# Altium schematic sheet ETH_Wifi.SCHDOC
size A3; SheetNumber: 0; SheetTotal: 0
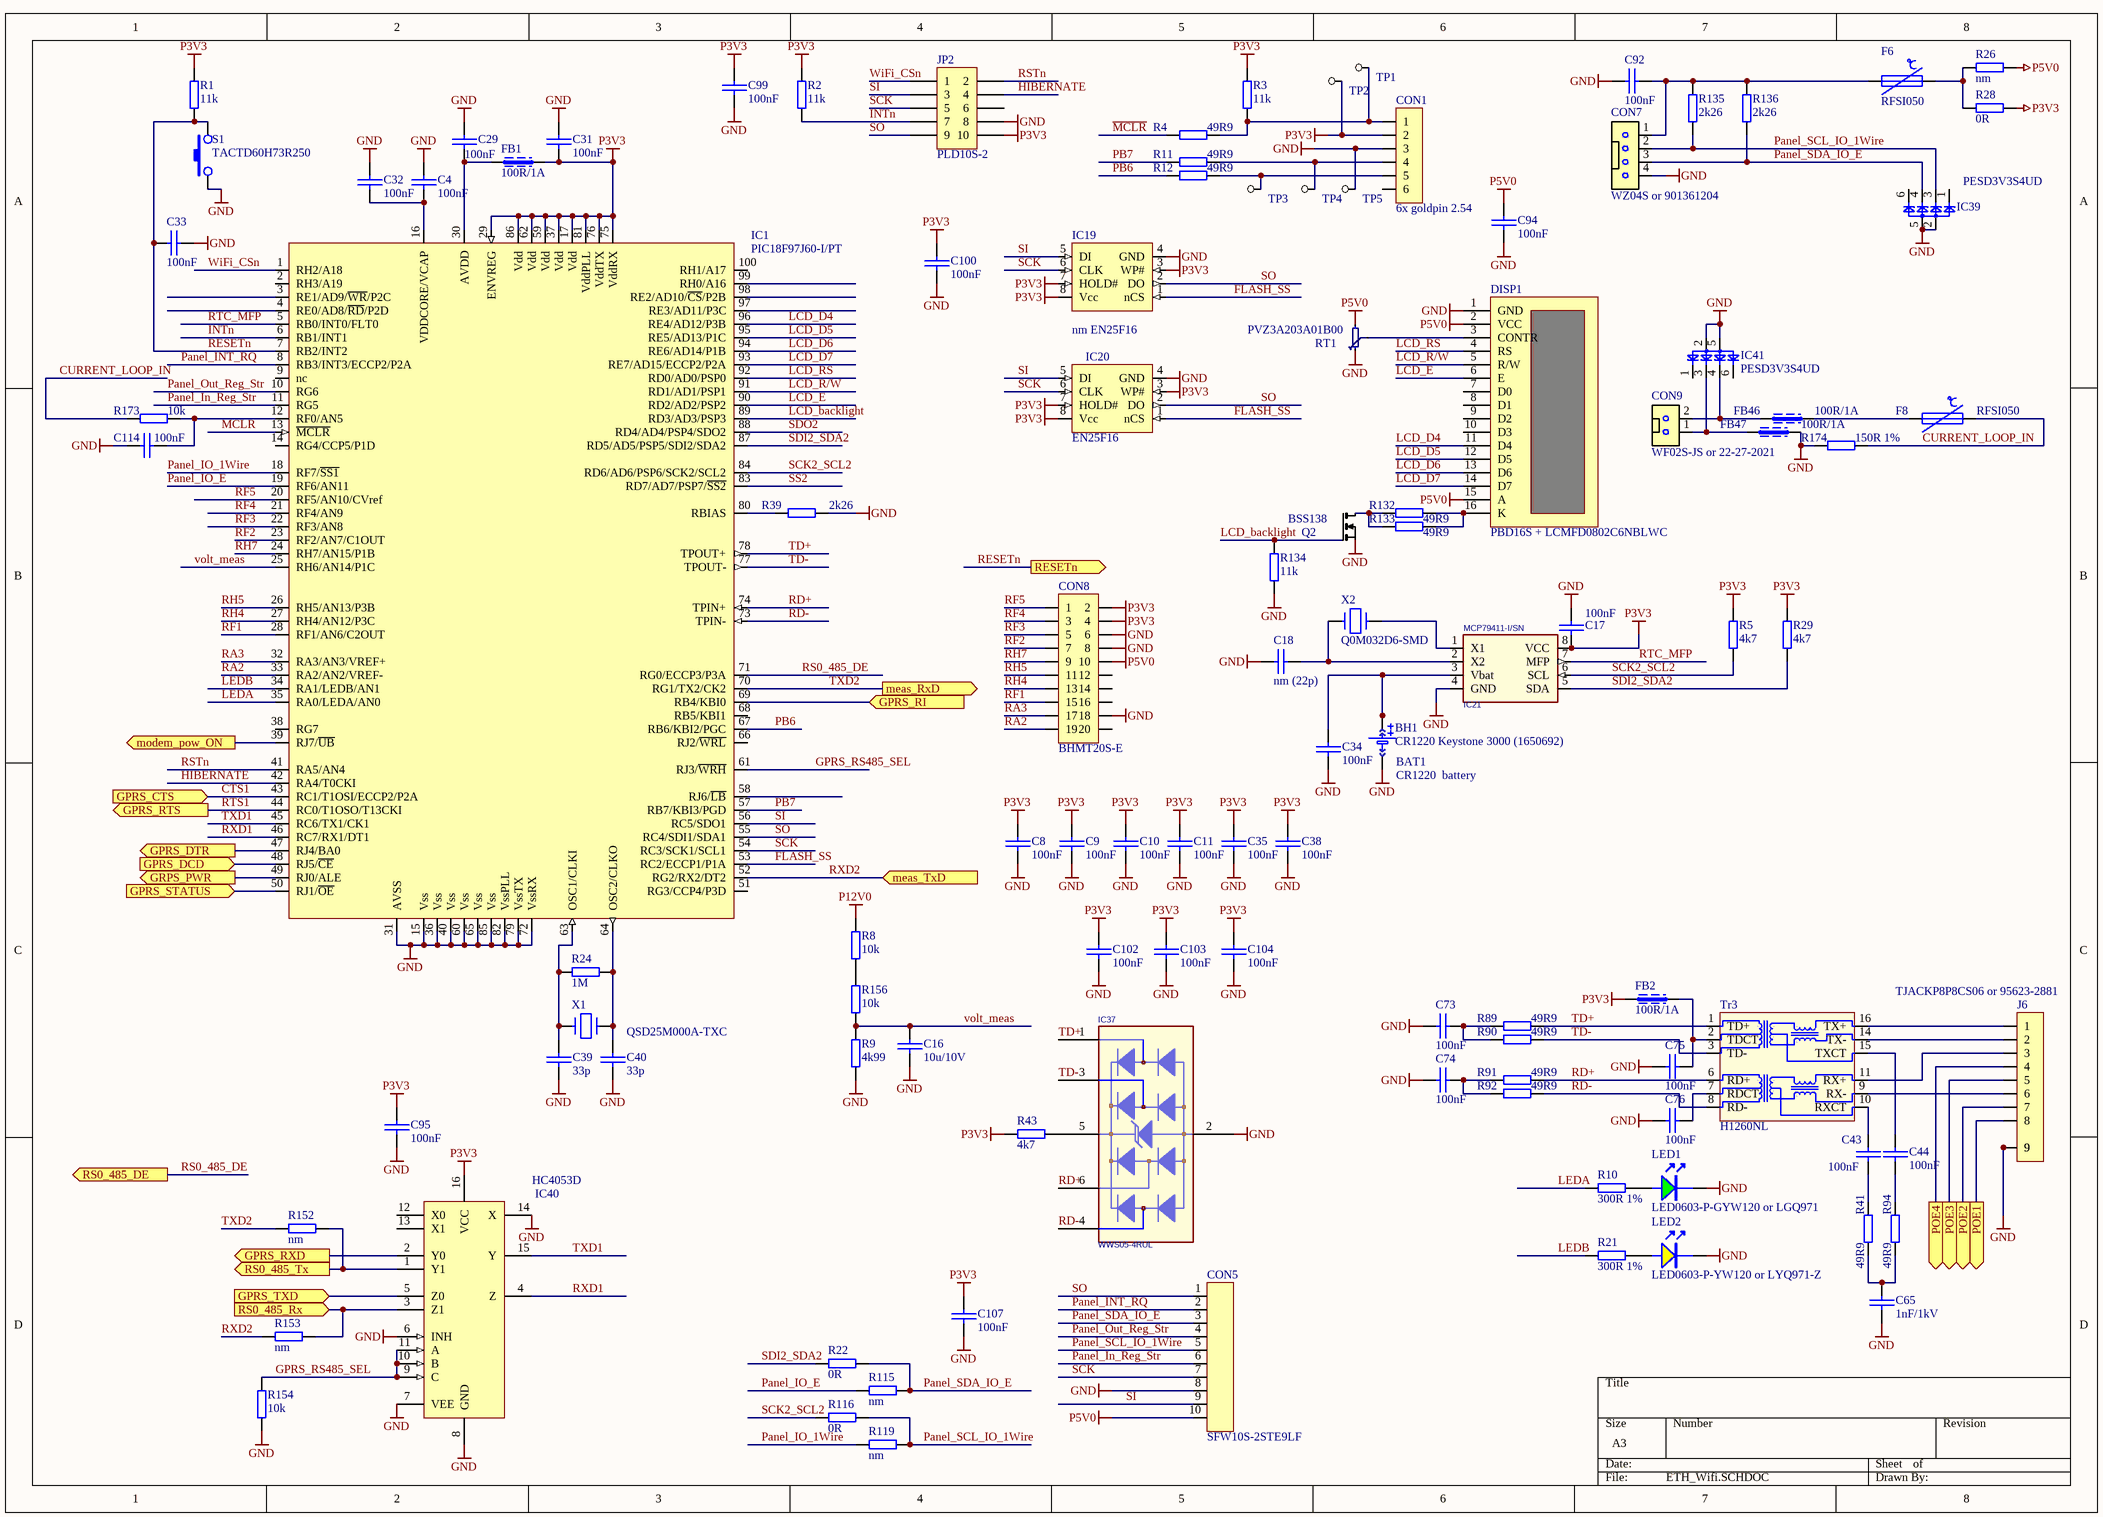
[diagram p0: ETH_Wifi.SCHDOC]

## Parts
BAT1  CR1220  battery  [cr1220]
BH1  CR1220 Keystone 3000 (1650692)  [CR1220_Keystone_3000]
C4  100nF  [0402C]
C8  100nF  [0402C]
C9  100nF  [0402C]
C10  100nF  [0402C]
C11  100nF  [0402C]
C16  10u/10V  [0805C]
C17  100nF  [0402C]
C18  nm (22p)  [0603C]
C29  100nF  [0402C]
C31  100nF  [0402C]
C32  100nF  [0402C]
C33  100nF  [0402C]
C34  100nF  [0402C]
C35  100nF  [0402C]
C38  100nF  [0402C]
C39  33p  [0603C]
C40  33p  [0603C]
C43  100nF  [0402C]
C44  100nF  [0402C]
C65  1nF/1kV  [1206C]
C73  100nF  [0402C]
C74  100nF  [0402C]
C75  100nF  [0402C]
C76  100nF  [0402C]
C92  100nF  [0402C]
C94  100nF  [0402C]
C95  100nF  [0402C]
C99  100nF  [0402C]
C100  100nF  [0402C]
C102  100nF  [0402C]
C103  100nF  [0402C]
C104  100nF  [0402C]
C107  100nF  [0402C]
C114  100nF  [0402C]
CON1  6x goldpin 2.54  [SIP6]
CON5  SFW10S-2STE9LF  [SFW10S-2STE9LF]
CON7  WZ04S or 901361204  [WZ04S]
CON8  BHMT20S-E  [BHMT20S]
CON9  WF02S-JS or 22-27-2021  [CON_WF02S-LF]
DISP1  PBD16S + LCMFD0802C6NBLWC  [LCMFD0802C6NBLWC]
F6  RFSI050  [0805R]
F8  RFSI050  [0805R]
FB1  100R/1A  [0603L]
FB2  100R/1A  [0603L]
FB46  100R/1A  [0603L]
FB47  100R/1A  [0603L]
IC1  PIC18F97J60-I/PT  [lqfp100_12x12mm]
IC19  nm EN25F16  [SO-8L]
IC20  EN25F16  [SO-8]
IC21  MCP79411-I/SN  [SO-8]
IC37  WWS05-4RUL  [SOT23-6]
IC39  PESD3V3S4UD  [SOT457]
IC40  HC4053D  [SO-16]
IC41  PESD3V3S4UD  [SOT457]
J6  TJACKP8P8CS06 or 95623-2881  [ETH_VERT_95623-2881]
JP2  PLD10S-2  [HEADER5X2]
LED1  LED0603-P-GYW120 or LGQ971  [led_0603G]
LED2  LED0603-P-YW120 or LYQ971-Z  [led_0603B]
Q2  BSS138  [SOT-23]
R1  11k  [0603R]
R2  11k  [0603R]
R3  11k  [0603R]
R4  49R9  [0603R]
R5  4k7  [0402R]
R8  10k  [0402R]
R9  4k99  [0603R]
R10  300R 1%  [0603R]
R11  49R9  [0603R]
R12  49R9  [0603R]
R21  300R 1%  [0603R]
R22  0R  [0603R]
R24  1M  [0603R]
R26  nm  [0603R]
R28  0R  [0603R]
R29  4k7  [0402R]
R39  2k26  [0603R]
R41  49R9  [0603]
R43  4k7  [0402R]
R89  49R9  [0603R]
R90  49R9  [0603R]
R91  49R9  [0603R]
R92  49R9  [0603R]
R94  49R9  [0603]
R115  nm  [0603R]
R116  0R  [0603R]
R119  nm  [0603R]
R132  49R9  [0603R]
R133  49R9  [0603R]
R134  11k  [0603R]
R135  2k26  [0603R]
R136  2k26  [0603R]
R152  nm  [0603R]
R153  nm  [0603R]
R154  10k  [0402R]
R156  10k  [0402R]
R173  10k  [0402R]
R174  150R 1%  [0805R]
RT1  PVZ3A203A01B00  [TRIMPOT_PVZ3A]
S1  TACTD60H73R250  [TACT-DQ62H73G160]
TP1  TP_nMCLR  [TP_large]  (value not drawn)
TP2  TP_3V3_ctrl  [TP_large]  (value not drawn)
TP3  TP_PB6  [TP_large]  (value not drawn)
TP4  TP_PB7  [TP_large]  (value not drawn)
TP5  TP_GND_ctrl  [TP_large]  (value not drawn)
Tr3  H1260NL  [H1260NL]
X1  QSD25M000A-TXC  [HC-49SM]
X2  Q0M032D6-SMD  [crystal_85SMX]

## Ports
GPRS_CTS (in), GPRS_DCD (in), GPRS_DTR (out), GPRS_RI (in), GPRS_RTS (out), GPRS_RXD (out), GPRS_STATUS (in), GPRS_TXD (in), GRPS_PWR (out), meas_RxD (out), meas_TxD (in), modem_pow_ON (out), POE1 (out), POE2 (out), POE3 (out), POE4 (out), RESETn (out), RS0_485_DE (out), RS0_485_Rx (in), RS0_485_Tx (out)

## Nets
GND: BH1.neg(+) C4.1 C8.1 C9.2 C10.2 C11.2 C16.2 C17.2 C18.2 C29.1 C31.1 C32.1 C33.2 C34.2 C35.2 C38.2 C39.1 C40.1 C65.2 C73.1 C74.1 C75.1 C76.1 C92.1 C94.1 C95.2 C99.2 C100.2 C102.2 C103.2 C104.2 C107.2 C114.1 CON1.3 CON5.8 CON7.4 CON8.6 CON8.8 CON8.18 DISP1.1(GND) FB47.2 IC1.15(Vss) IC1.31(AVSS) IC1.36(Vss) IC1.40(Vss) IC1.60(Vss) IC1.65(Vss) IC1.72(VssRX) IC1.79(VssTX) IC1.82(VssPLL) IC1.85(Vss) IC19.4(GND) IC20.4(GND) IC21.4(GND) IC37.2 IC39.2 IC39.5 IC40.6(INH) IC40.7(VEE) IC40.8(GND) IC40.14(X) IC41.2 IC41.5 J6.9a(9) J6.9b(9) JP2.8 LED1.K LED2.K Q2.2(S) R9.1 R39.2 R134.1 R154.1 R174.1 RT1.3 S1.1 TP5.1
P3V3: C8.2 C9.1 C10.1 C11.1 C17.1 C31.2 C35.1 C38.1 C95.1 C99.1 C100.1 C102.1 C103.1 C104.1 C107.1 CON1.2 CON8.2 CON8.4 FB1.2 FB2.1 IC1.17(Vdd) IC1.29(ENVREG) IC1.37(Vdd) IC1.59(Vdd) IC1.62(Vdd) IC1.75(VddRX) IC1.76(VddTX) IC1.81(VddPLL) IC1.86(Vdd) IC19.3(WP#) IC19.7(HOLD#) IC19.8(Vcc) IC20.3(WP#) IC20.7(HOLD#) IC20.8(Vcc) IC21.8(VCC) IC40.16(VCC) JP2.10 R1.2 R2.2 R3.2 R5.1 R28.2 R29.1 R43.1 TP2.1
P5V0: C94.2 CON5.10 CON8.10 DISP1.2(VCC) DISP1.15(A) R26.2 RT1.1
P12V0: R8.2
CTS1: IC1.43(RC1/T1OSI/ECCP2/P2A) ; port GPRS_CTS
CURRENT_LOOP_IN: F8.2 R173.1 R174.2
FLASH_SS: IC1.53(RC2/ECCP1/P1A) IC19.1(nCS) IC20.1(nCS)
GPRS_DCD: IC1.48(RJ5/~{CE}) ; port GPRS_DCD
GPRS_DTR: IC1.47(RJ4/BA0) ; port GPRS_DTR
GPRS_RI: IC1.69(RB4/KBI0) ; port GPRS_RI
GPRS_RS485_SEL: IC1.61(RJ3/~{WRH}) IC40.9(C) IC40.10(B) IC40.11(A) R154.2
GPRS_RXD: IC40.2(Y0) ; port GPRS_RXD
GPRS_STATUS: IC1.50(RJ1/~{OE}) ; port GPRS_STATUS
GPRS_TXD: IC40.5(Z0) ; port GPRS_TXD
GRPS_PWR: IC1.49(RJ0/ALE) ; port GRPS_PWR
HIBERNATE: IC1.42(RA4/T0CKI) JP2.4
INTn: IC1.6(RB1/INT1) JP2.7 R2.1
LCD_backlight: IC1.89(RD3/AD3/PSP3) Q2.1(G) R134.2
LCD_D4: DISP1.11(D4) IC1.96(RE4/AD12/P3B)
LCD_D5: DISP1.12(D5) IC1.95(RE5/AD13/P1C)
LCD_D6: DISP1.13(D6) IC1.94(RE6/AD14/P1B)
LCD_D7: DISP1.14(D7) IC1.93(RE7/AD15/ECCP2/P2A)
LCD_E: DISP1.6(E) IC1.90(RD2/AD2/PSP2)
LCD_R/W: DISP1.5(R/W) IC1.91(RD1/AD1/PSP1)
LCD_RS: DISP1.4(RS) IC1.92(RD0/AD0/PSP0)
LEDA: IC1.35(RA0/LEDA/AN0) R10.2
LEDB: IC1.34(RA1/LEDB/AN1) R21.2
~{MCLR}: IC1.13(~{MCLR}) R4.1
modem_pow_ON: IC1.39(RJ7/~{UB}) ; port modem_pow_ON
Panel_In_Reg_Str: CON5.6 IC1.11(RG5)
Panel_INT_RQ: CON5.2 IC1.8(RB3/INT3/ECCP2/P2A)
Panel_IO_1Wire: IC1.18(RF7/~{SS1}) R119.2
Panel_IO_E: IC1.19(RF6/AN11) R115.2
Panel_Out_Reg_Str: CON5.4 IC1.10(RG6)
Panel_SCL_IO_1Wire: CON5.5 CON7.2 IC39.3 R116.1 R119.1 R135.2
Panel_SDA_IO_E: CON5.3 CON7.3 IC39.4 R22.1 R115.1 R136.2
PB6: IC1.67(RB6/KBI2/PGC) R12.1
PB7: IC1.57(RB7/KBI3/PGD) R11.1
POE1: J6.8 ; port POE1
POE2: J6.7 ; port POE2
POE3: J6.5 ; port POE3
POE4: J6.4 ; port POE4
RA2: CON8.19 IC1.33(RA2/AN2/VREF-)
RA3: CON8.17 IC1.32(RA3/AN3/VREF+)
RD+: IC1.74(TPIN+) IC37.6 R91.2 Tr3.6(RD+)
RD-: IC1.73(TPIN-) IC37.4 R92.2 Tr3.8(RD-)
RESETn: C33.1 IC1.7(RB2/INT2) R1.1 S1.2 ; port RESETn
RF1: CON8.15 IC1.28(RF1/AN6/C2OUT)
RF2: CON8.7 IC1.23(RF2/AN7/C1OUT)
RF3: CON8.5 IC1.22(RF3/AN8)
RF4: CON8.3 IC1.21(RF4/AN9)
RF5: CON8.1 IC1.20(RF5/AN10/CVref)
RH4: CON8.13 IC1.27(RH4/AN12/P3C)
RH5: CON8.11 IC1.26(RH5/AN13/P3B)
RH7: CON8.9 IC1.24(RH7/AN15/P1B)
RS0_485_DE: IC1.71(RG0/ECCP3/P3A) ; port RS0_485_DE
RS0_485_Rx: IC40.3(Z1) R153.1 ; port RS0_485_Rx
RS0_485_Tx: IC40.1(Y1) R152.1 ; port RS0_485_Tx
RSTn: IC1.41(RA5/AN4) JP2.2
RTC_MFP: IC1.5(RB0/INT0/FLT0) IC21.7(MFP)
RTS1: IC1.44(RC0/T1OSO/T13CKI) ; port GPRS_RTS
RXD1: IC1.46(RC7/RX1/DT1) IC40.4(Z)
RXD2: IC1.52(RG2/RX2/DT2) R153.2 ; port meas_TxD
SCK: CON5.7 IC1.54(RC3/SCK1/SCL1) IC19.6(CLK) IC20.6(CLK) JP2.5
SCK2_SCL2: IC1.84(RD6/AD6/PSP6/SCK2/SCL2) IC21.6(SCL) R5.2 R116.2
SDI2_SDA2: IC1.87(RD5/AD5/PSP5/SDI2/SDA2) IC21.5(SDA) R22.2 R29.2
SDO2: IC1.88(RD4/AD4/PSP4/SDO2)
SI: CON5.9 IC1.56(RC5/SDO1) IC19.5(DI) IC20.5(DI) JP2.3
SO: CON5.1 IC1.55(RC4/SDI1/SDA1) IC19.2(DO) IC20.2(DO) JP2.9
SS2: IC1.83(RD7/AD7/PSP7/~{SS2})
TD+: IC1.78(TPOUT+) IC37.1 R89.2 Tr3.1(TD+)
TD-: IC1.77(TPOUT-) IC37.3 R90.2 Tr3.3(TD-)
TXD1: IC1.45(RC6/TX1/CK1) IC40.15(Y)
TXD2: IC1.70(RG1/TX2/CK2) R152.2 ; port meas_RxD
volt_meas: C16.1 IC1.25(RH6/AN14/P1C) R9.2 R156.1
WiFi_CSn: IC1.1(RH2/A18) JP2.1
NetBH1_pos1: BH1.pos1(+) BH1.pos2(+) C34.1 IC21.3(Vbat)
NetC4_2: C4.2 C32.2 IC1.16(VDDCORE/VCAP)
NetC18_1: C18.1 IC21.2(X2) X2.4
NetC29_2: C29.2 FB1.1 IC1.30(AVDD)
NetC39_2: C39.2 IC1.63(OSC1/CLKI) R24.1 X1.1
NetC40_2: C40.2 IC1.64(OSC2/CLKO) R24.2 X1.2
NetC43_1: C43.1 R41.2
NetC43_2: C43.2 Tr3.10(RXCT)
NetC44_1: C44.1 R94.2
NetC44_2: C44.2 Tr3.15(TXCT)
NetC65_1: C65.1 R41.1 R94.1
NetC73_2: C73.2 R89.1 R90.1
NetC74_2: C74.2 R91.1 R92.1
NetC75_2: C75.2 FB2.2 Tr3.2(TDCT)
NetC76_2: C76.2 Tr3.7(RDCT)
NetC92_2: C92.2 CON7.1 F6.1 R135.1 R136.1
NetC114_2: C114.2 IC1.12(RF0/AN5) R173.2
NetCON1_1: CON1.1 R3.1 R4.2 TP1.1
NetCON1_4: CON1.4 R11.2 TP4.1
NetCON1_5: CON1.5 R12.2 TP3.1
NetCON9_1: CON9.1 FB47.1 IC41.3
NetCON9_2: CON9.2 FB46.1 IC41.4
NetDISP1_3: DISP1.3(CONTR) RT1.2
NetDISP1_16: DISP1.16(K) R132.2 R133.2
NetF6_2: F6.2 R26.1 R28.1
NetF8_1: F8.1 FB46.2
NetIC1_80: IC1.80(RBIAS) R39.1
NetIC21_1: IC21.1(X1) X2.1
NetIC37_5: IC37.5 R43.2
NetJ6_1: J6.1 Tr3.16(TX+)
NetJ6_2: J6.2 Tr3.14(TX-)
NetJ6_3: J6.3 Tr3.11(RX+)
NetJ6_6: J6.6 Tr3.9(RX-)
NetLED1_A: LED1.A R10.1
NetLED2_A: LED2.A R21.1
NetQ2_3: Q2.3(D) R132.1 R133.1
NetR8_1: R8.1 R156.2

Not connected (* = marked no-connect by the designer): CON1 6; CON8 12 14 16 20; DISP1 7(D0) 8(D1) 9(D2) 10(D3); IC1 2(RH3/A19) 3(RE1/AD9/~{WR}/P2C) 4(RE0/AD8/~{RD}/P2D) 9(nc) 14(RG4/CCP5/P1D) 38(RG7) 51(RG3/CCP4/P3D) 58(RJ6/~{LB}) 66(RJ2/~{WRL}) 68(RB5/KBI1) 97(RE3/AD11/P3C) 98(RE2/AD10/~{CS}/P2B) 99(RH0/A16) 100(RH1/A17); IC39 1 6; IC40 12(X0) 13(X1); IC41 1 6; JP2 6

## Library data of the parts
BAT1 = BATTERY_CR1220: CR-21220 Battery 3V 35mAh; Supplier 1: Farnell; Supplier Part Number 1: 1892664
BH1 = BATTERY_HOLD_CR1220: CR-1220 Battery holder; Supplier 1: Newark; Supplier Part Number 1: 66F5622
C4 C8-C11 C17 C29 C31-C35 C38 C43 C44 C73-C76 C92 C94 C95 C99 C100 C102-C104 C107 C114 = CAP_SMD_0402: Capacitor SMD; Supplier 1: Newark; Supplier Part Number 1: 14T3275
C16 = CAP_SMD_0805: Capacitor SMD; Supplier 1: Farnell; Supplier Part Number 1: 1833812
C18 = CAP_SMD_0603: Capacitor SMD
C39 C40 = CAP_SMD: Capacitor SMD
C65 = CAP_SMD_1206: Capacitor SMD; Supplier 1: Newark; Supplier Part Number 1: 90R7810
CON1 = CON6
CON5 = CON_ZIF_10_1mm_SMT_V: FCI ZIF 1mm connector (Farnell)
CON7 = CON_4_2.54_key: 2.54mm crimped terminal header
CON8 = CON_IDC20_SMT_2mm: 20 pin, IDC receptacle, 2mm
CON9 = CON_2_2.54_key: 2.54mm crimped terminal header
DISP1 = LCD_HD44780_LED_2x8: LCD character display socket with backlight
F6 F8 = F_PTC_0.05A: 50mA polymer FUSE
FB1 FB2 FB46 FB47 = L_FERRITE_BEAD: ferrite bead
IC1 = UPC_PIC18F96J65_PT
IC19 IC20 = MEM_EN25F16: FLASH (maritex)
IC21 = RTC_MCP79411: RTC with 1k EEPROM, RAM and 48bit unique ID; Supplier 1: Newark; Supplier Part Number 1: 76R6660
IC37 = D_TVS_WWS05-4RUL: TVS, 5V; Specification: SMD,ESD COMPONENT,ROHS
IC39 IC41 = D_TVS_PESD3V3S4UD: 3.3V TVS
IC40 = 4053
J6 = CON_MOD_8pin_V: Modular 8pin (Maritex or Molex)
JP2 = CON_HEADER 5X2: Goldpin 2.54mm
LED1 = LED_0603G: LED 0603 green; Supplier 1: Newark; Supplier Part Number 1: 05M0493
LED2 = LED_0603Y: LED 0603 yellow; Supplier 1: Newark; Supplier Part Number 1: 56P5112
Q2 = Q_BSS138
R1-R4 R10-R12 R21 R24 R39 R41 R89-R92 R94 R134 = RES_SMD: SMD Resistor
R5 R8 R29 R43 R154 R156 R173 = RES_0402: SMD Resistor; Supplier 1: Newark; Supplier Part Number 1: 59M6691
R9 R22 R26 R28 R115 R116 R119 R132 R133 R135 R136 R152 R153 = RES_0603: SMD Resistor
  R26 R28 R132 R133 R135 R136: Supplier 1: Newark; Supplier Part Number 1: 39K0073
R174 = RES_0805: SMD Resistor; Supplier 1: Newark; Supplier Part Number 1: 05F1507
RT1 = TRIMPOT_SMD_CARBON: carbon SMD trimpot (Farnell)
S1 = SW-PB: Push button 7.3mm
TP1-TP5 = TP: Testpoint
Tr3 = TR_H1260NL: ethernet trafo (TME)
X1 = CRYSTAL: Crystal oscillator
X2 = X_CRYSTAL_32k_SMD: Crystal oscillator 32k (Maritex); Supplier 1: Farnell; Supplier Part Number 1: 1832136